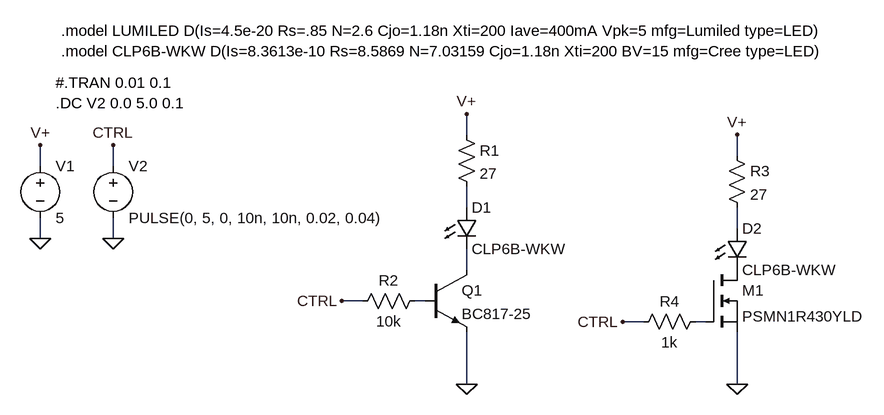
[diagram p0: schematic led_driver.asc]
led_driver.asc, the LTspice schematic file:
Version 4
SHEET 1 972 680
WIRE 368 48 368 16
WIRE 784 80 784 48
WIRE -288 96 -288 64
WIRE -176 96 -176 64
WIRE 368 160 368 128
WIRE 784 192 784 160
WIRE -288 208 -288 176
WIRE -176 208 -176 176
WIRE 368 256 368 224
WIRE 208 304 176 304
WIRE 304 304 288 304
WIRE 640 336 608 336
WIRE 736 336 720 336
WIRE 368 432 368 352
WIRE 784 432 784 352
FLAG -288 64 V+
FLAG -288 208 0
FLAG 368 16 V+
FLAG 368 432 0
FLAG 176 304 CTRL
FLAG -176 64 CTRL
FLAG -176 208 0
FLAG 784 48 V+
FLAG 784 432 0
FLAG 608 336 CTRL
SYMBOL npn 304 256 R0
SYMATTR InstName Q1
SYMATTR Value BC817-25
SYMBOL voltage -288 80 R0
SYMATTR InstName V1
SYMATTR Value 5
SYMBOL voltage -176 80 R0
SYMATTR InstName V2
SYMATTR Value PULSE(0, 5, 0, 10n, 10n, 0.02, 0.04)
SYMBOL LED 352 160 R0
SYMATTR InstName D1
SYMATTR Value CLP6B-WKW
SYMBOL res 352 32 R0
SYMATTR InstName R1
SYMATTR Value 27
SYMBOL res 304 288 R90
WINDOW 0 0 56 VBottom 2
WINDOW 3 32 56 VTop 2
SYMATTR InstName R2
SYMATTR Value 10k
SYMBOL nmos 736 256 R0
SYMATTR InstName M1
SYMATTR Value PSMN1R430YLD
SYMBOL LED 768 192 R0
SYMATTR InstName D2
SYMATTR Value CLP6B-WKW
SYMBOL res 768 64 R0
SYMATTR InstName R3
SYMATTR Value 27
SYMBOL res 736 320 R90
WINDOW 0 0 56 VBottom 2
WINDOW 3 32 56 VTop 2
SYMATTR InstName R4
SYMATTR Value 1k
TEXT -264 -32 Left 2 !#.TRAN 0.01 0.1\n.DC V2 0.0 5.0 0.1
TEXT -256 -112 Left 2 !.model LUMILED D(Is=4.5e-20 Rs=.85 N=2.6 Cjo=1.18n Xti=200 Iave=400mA Vpk=5 mfg=Lumiled type=LED)\n.model CLP6B-WKW D(Is=8.3613e-10 Rs=8.5869 N=7.03159 Cjo=1.18n Xti=200 BV=15 mfg=Cree type=LED)

The netlist it stands for:
* led_driver.asc
Q1 N003 N004 0 0 BC817-25
V1 V+ 0 5
V2 CTRL 0 PULSE(0, 5, 0, 10n, 10n, 0.02, 0.04)
D1 N001 N003 CLP6B-WKW
R1 V+ N001 27
R2 N004 CTRL 10k
M1 P001 N005 0 0 PSMN1R430YLD
D2 N002 P001 CLP6B-WKW
R3 V+ N002 27
R4 N005 CTRL 1k
.model D D
.lib standard.dio
.model NPN NPN
.model PNP PNP
.lib standard.bjt
.model NMOS NMOS
.model PMOS PMOS
.lib standard.mos
#.TRAN 0.01 0.1
.DC V2 0.0 5.0 0.1
.model LUMILED D(Is=4.5e-20 Rs=.85 N=2.6 Cjo=1.18n Xti=200 Iave=400mA Vpk=5 mfg=Lumiled type=LED)
.model CLP6B-WKW D(Is=8.3613e-10 Rs=8.5869 N=7.03159 Cjo=1.18n Xti=200 BV=15 mfg=Cree type=LED)
.backanno
.end